# EAGLE design schemat (EAGLE 9.6.2)
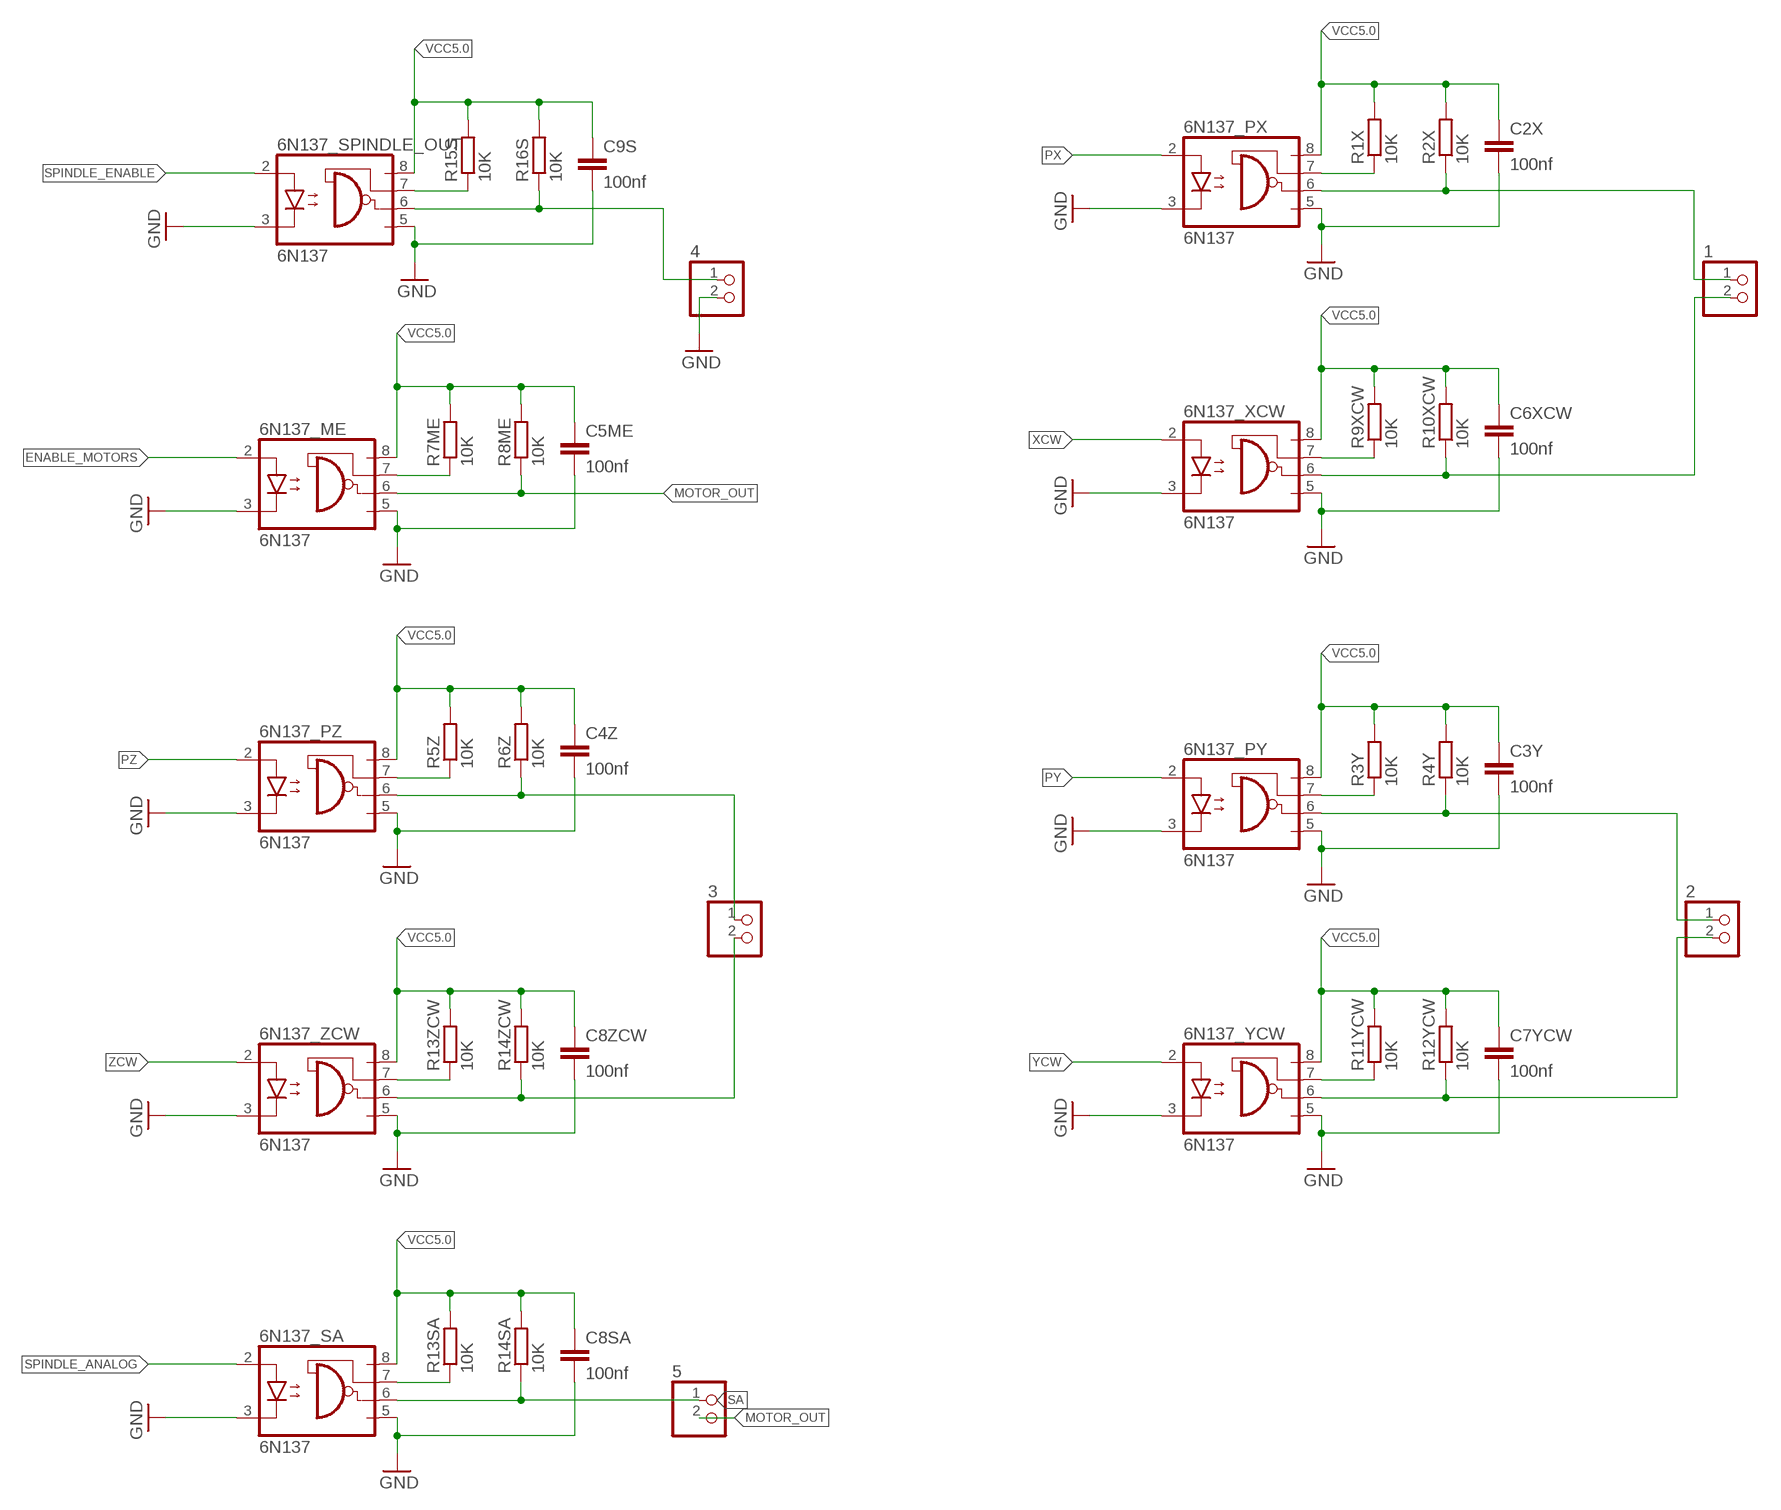
[diagram p0: schematic, sheet 1, part 1 of 2]
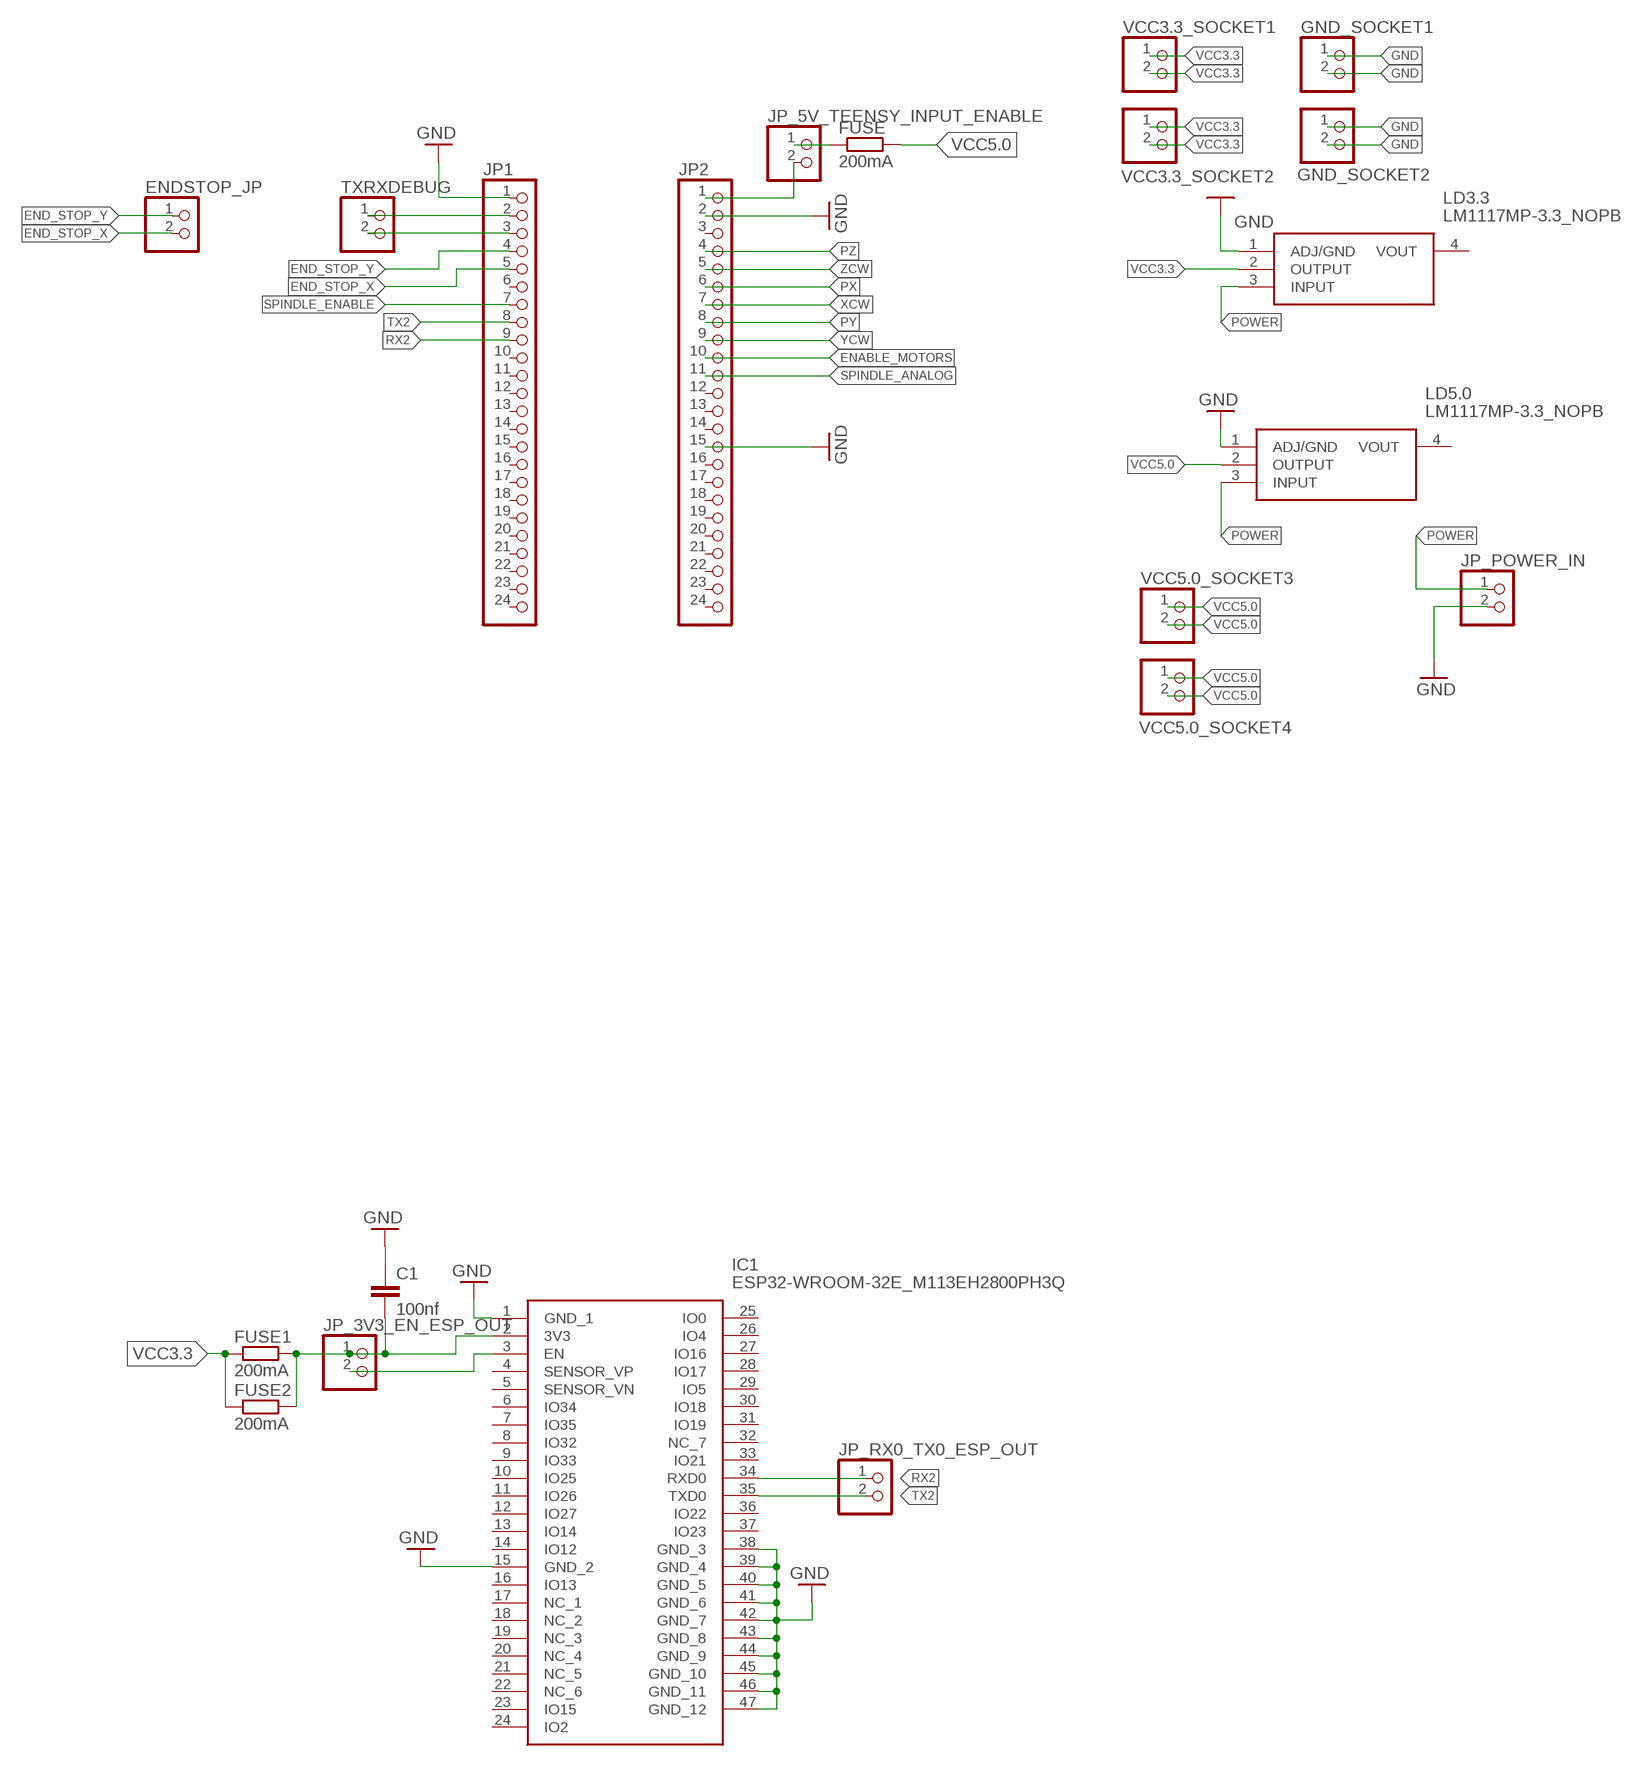
[diagram p1: schematic, sheet 1, part 2 of 2]

## Parts
1  PINHD-1X2  [1X02]
2  PINHD-1X2  [1X02]
3  PINHD-1X2  [1X02]
4  PINHD-1X2  [1X02]
5  PINHD-1X2  [1X02]
6N137_ME  6N137  [DIL08]
6N137_PX  6N137  [DIL08]
6N137_PY  6N137  [DIL08]
6N137_PZ  6N137  [DIL08]
6N137_SA  6N137  [DIL08]
6N137_SPINDLE_OUT  6N137  [DIL08]
6N137_XCW  6N137  [DIL08]
6N137_YCW  6N137  [DIL08]
6N137_ZCW  6N137  [DIL08]
C1  100nf  C-EUC0805  [C0805]
C2X  100nf  C-EUC0805  [C0805]
C3Y  100nf  C-EUC0805  [C0805]
C4Z  100nf  C-EUC0805  [C0805]
C5ME  100nf  C-EUC0805  [C0805]
C6XCW  100nf  C-EUC0805  [C0805]
C7YCW  100nf  C-EUC0805  [C0805]
C8SA  100nf  C-EUC0805  [C0805]
C8ZCW  100nf  C-EUC0805  [C0805]
C9S  100nf  C-EUC0805  [C0805]
ENDSTOP_JP  PINHD-1X2  [1X02]
FUSE  200mA  R-EU_R2512  [R2512]
FUSE1  200mA  R-EU_R2512  [R2512]
FUSE2  200mA  R-EU_R2512  [R2512]
GND_SOCKET1  PINHD-1X2  [1X02]
GND_SOCKET2  PINHD-1X2  [1X02]
IC1  ESP32-WROOM-32E_M113EH2800PH3Q  [ESP32WROOM32EM113EH2800PH3Q0]
JP1  PINHD-1X24  [1X24]
JP2  PINHD-1X24  [1X24]
JP_3V3_EN_ESP_OUT  PINHD-1X2  [1X02]
JP_5V_TEENSY_INPUT_ENABLE  PINHD-1X2  [1X02]
JP_POWER_IN  PINHD-1X2  [1X02]
JP_RX0_TX0_ESP_OUT  PINHD-1X2  [1X02]
LD3.3  LM1117MP-3.3_NOPB  [SOT230P700X180-4N]
LD5.0  LM1117MP-3.3_NOPB  [SOT230P700X180-4N]
R1X  10K  R-EU_R0805  [R0805]
R2X  10K  R-EU_R0805  [R0805]
R3Y  10K  R-EU_R0805  [R0805]
R4Y  10K  R-EU_R0805  [R0805]
R5Z  10K  R-EU_R0805  [R0805]
R6Z  10K  R-EU_R0805  [R0805]
R7ME  10K  R-EU_R0805  [R0805]
R8ME  10K  R-EU_R0805  [R0805]
R9XCW  10K  R-EU_R0805  [R0805]
R10XCW  10K  R-EU_R0805  [R0805]
R11YCW  10K  R-EU_R0805  [R0805]
R12YCW  10K  R-EU_R0805  [R0805]
R13SA  10K  R-EU_R0805  [R0805]
R13ZCW  10K  R-EU_R0805  [R0805]
R14SA  10K  R-EU_R0805  [R0805]
R14ZCW  10K  R-EU_R0805  [R0805]
R15S  10K  R-EU_R0805  [R0805]
R16S  10K  R-EU_R0805  [R0805]
TXRXDEBUG  PINHD-1X2  [1X02]
VCC3.3_SOCKET1  PINHD-1X2  [1X02]
VCC3.3_SOCKET2  PINHD-1X2  [1X02]
VCC5.0_SOCKET3  PINHD-1X2  [1X02]
VCC5.0_SOCKET4  PINHD-1X2  [1X02]

## Nets
ENABLE_MOTORS: 6N137_ME.2(A) JP2.10
END_STOP_X: ENDSTOP_JP.2 JP1.5
END_STOP_Y: ENDSTOP_JP.1 JP1.4
GND: 4.2 6N137_ME.3(C) 6N137_ME.5(GND) 6N137_PX.3(C) 6N137_PX.5(GND) 6N137_PY.3(C) 6N137_PY.5(GND) 6N137_PZ.3(C) 6N137_PZ.5(GND) 6N137_SA.3(C) 6N137_SA.5(GND) 6N137_SPINDLE_OUT.3(C) 6N137_SPINDLE_OUT.5(GND) 6N137_XCW.3(C) 6N137_XCW.5(GND) 6N137_YCW.3(C) 6N137_YCW.5(GND) 6N137_ZCW.3(C) 6N137_ZCW.5(GND) C1.1 C2X.2 C3Y.2 C4Z.2 C5ME.2 C6XCW.2 C7YCW.2 C8SA.2 C8ZCW.2 C9S.2 GND_SOCKET1.1 GND_SOCKET1.2 GND_SOCKET2.1 GND_SOCKET2.2 IC1.1(GND_1) IC1.15(GND_2) IC1.38(GND_3) IC1.39(GND_4) IC1.40(GND_5) IC1.41(GND_6) IC1.42(GND_7) IC1.43(GND_8) IC1.44(GND_9) IC1.45(GND_10) IC1.46(GND_11) IC1.47(GND_12) JP1.1 JP2.2 JP2.15 JP_POWER_IN.2 LD3.3.1(ADJ/GND) LD5.0.1(ADJ/GND)
MOTOR_OUT: 5.2 6N137_ME.6(VO) R8ME.1
N$1: JP2.1 JP_5V_TEENSY_INPUT_ENABLE.2
N$2: JP1.2 TXRXDEBUG.1
N$3: IC1.3(EN) JP_3V3_EN_ESP_OUT.2
N$4: JP1.3 TXRXDEBUG.2
N$5: 6N137_PX.7(VE) R1X.1
N$6: 6N137_PY.7(VE) R3Y.1
N$7: 6N137_PZ.7(VE) R5Z.1
N$8: 6N137_ME.7(VE) R7ME.1
N$9: 6N137_SPINDLE_OUT.7(VE) R15S.1
N$10: 6N137_XCW.7(VE) R9XCW.1
N$11: 6N137_YCW.7(VE) R11YCW.1
N$12: 6N137_ZCW.7(VE) R13ZCW.1
N$13: FUSE.1 JP_5V_TEENSY_INPUT_ENABLE.1
N$14: C1.2 FUSE1.2 FUSE2.2 IC1.2(3V3) JP_3V3_EN_ESP_OUT.1
N$15: 6N137_SA.7(VE) R13SA.1
POWER: JP_POWER_IN.1 LD3.3.3(INPUT) LD5.0.3(INPUT)
PX: 6N137_PX.2(A) JP2.6
PX_OUT: 1.1 6N137_PX.6(VO) R2X.1
PY: 6N137_PY.2(A) JP2.8
PY_OUT: 2.1 6N137_PY.6(VO) R4Y.1
PZ: 6N137_PZ.2(A) JP2.4
PZ_OUT: 3.1 6N137_PZ.6(VO) R6Z.1
RX2: IC1.34(RXD0) JP1.9 JP_RX0_TX0_ESP_OUT.1
SA: 5.1 6N137_SA.6(VO) R14SA.1
SPINDLE_ANALOG: 6N137_SA.2(A) JP2.11
SPINDLE_ENABLE: 6N137_SPINDLE_OUT.2(A) JP1.7
SPINDLE_OUT: 4.1 6N137_SPINDLE_OUT.6(VO) R16S.1
TX2: IC1.35(TXD0) JP1.8 JP_RX0_TX0_ESP_OUT.2
VCC3.3: FUSE1.1 FUSE2.1 LD3.3.2(OUTPUT) VCC3.3_SOCKET1.1 VCC3.3_SOCKET1.2 VCC3.3_SOCKET2.1 VCC3.3_SOCKET2.2
VCC5.0: 6N137_ME.8(VCC) 6N137_PX.8(VCC) 6N137_PY.8(VCC) 6N137_PZ.8(VCC) 6N137_SA.8(VCC) 6N137_SPINDLE_OUT.8(VCC) 6N137_XCW.8(VCC) 6N137_YCW.8(VCC) 6N137_ZCW.8(VCC) C2X.1 C3Y.1 C4Z.1 C5ME.1 C6XCW.1 C7YCW.1 C8SA.1 C8ZCW.1 C9S.1 FUSE.2 LD5.0.2(OUTPUT) R1X.2 R2X.2 R3Y.2 R4Y.2 R5Z.2 R6Z.2 R7ME.2 R8ME.2 R9XCW.2 R10XCW.2 R11YCW.2 R12YCW.2 R13SA.2 R13ZCW.2 R14SA.2 R14ZCW.2 R15S.2 R16S.2 VCC5.0_SOCKET3.1 VCC5.0_SOCKET3.2 VCC5.0_SOCKET4.1 VCC5.0_SOCKET4.2
XCW: 6N137_XCW.2(A) JP2.7
XCW_OUT: 1.2 6N137_XCW.6(VO) R10XCW.1
YCW: 6N137_YCW.2(A) JP2.9
YCW_OUT: 2.2 6N137_YCW.6(VO) R12YCW.1
ZCW: 6N137_ZCW.2(A) JP2.5
ZCW_OUT: 3.2 6N137_ZCW.6(VO) R14ZCW.1
Unconnected: IC1.4(SENSOR_VP) IC1.5(SENSOR_VN) IC1.6(IO34) IC1.7(IO35) IC1.8(IO32) IC1.9(IO33) IC1.10(IO25) IC1.11(IO26) IC1.12(IO27) IC1.13(IO14) IC1.14(IO12) IC1.16(IO13) IC1.17(NC_1) IC1.18(NC_2) IC1.19(NC_3) IC1.20(NC_4) IC1.21(NC_5) IC1.22(NC_6) IC1.23(IO15) IC1.24(IO2) IC1.25(IO0) IC1.26(IO4) IC1.27(IO16) IC1.28(IO17) IC1.29(IO5) IC1.30(IO18) IC1.31(IO19) IC1.32(NC_7) IC1.33(IO21) IC1.36(IO22) IC1.37(IO23) JP1.6 JP1.10 JP1.11 JP1.12 JP1.13 JP1.14 JP1.15 JP1.16 JP1.17 JP1.18 JP1.19 JP1.20 JP1.21 JP1.22 JP1.23 JP1.24 JP2.3 JP2.12 JP2.13 JP2.14 JP2.16 JP2.17 JP2.18 JP2.19 JP2.20 JP2.21 JP2.22 JP2.23 JP2.24 LD3.3.4(VOUT) LD5.0.4(VOUT)

## Library data of the parts
1-5 ENDSTOP_JP GND_SOCKET1 GND_SOCKET2 JP_3V3_EN_ESP_OUT JP_5V_TEENSY_INPUT_ENABLE JP_POWER_IN JP_RX0_TX0_ESP_OUT TXRXDEBUG VCC3.3_SOCKET1 VCC3.3_SOCKET2 VCC5.0_SOCKET3 VCC5.0_SOCKET4 = pinhead:PINHD-1X2: PIN HEADER
6N137_ME 6N137_PX 6N137_PY 6N137_PZ 6N137_SA 6N137_SPINDLE_OUT 6N137_XCW 6N137_YCW 6N137_ZCW = optocoupler:6N137: MOTOROLA OPTO COUPLER; MPN: 6N137; OC_FARNELL: 1328376; OC_NEWARK: 52M1895
C1 C2X C3Y C4Z C5ME C6XCW C7YCW C8SA C8ZCW C9S = rcl:C-EU: CAPACITOR, European symbol; SPICEPREFIX: C
FUSE FUSE1 FUSE2 R1X R2X R3Y R4Y R5Z R6Z R7ME R8ME R9XCW R10XCW R11YCW R12YCW R13SA R13ZCW R14SA R14ZCW R15S R16S = rcl:R-EU_: RESISTOR, European symbol; SPICEPREFIX: R
IC1 = SamacSys_Parts:ESP32-WROOM-32E_M113EH2800PH3Q: WiFi Modules (802.11) SMD Module ESP32-D0WD-V3, 16 MB SPI flash, PCB antenna Source: Datasheet <https://br.mouser.com/datasheet/2/891/esp32-wroom-32e_esp32-wroom-32ue_datasheet_en-1855879.pdf>; DESCRIPTION: WiFi Modules (802.11) SMD Module ESP32-D0WD-V3, 16 MB SPI flash, PCB antenna; HEIGHT: 3.35mm; MANUFACTURER_NAME: Espressif Systems; MANUFACTURER_PART_NUMBER: ESP32-WROOM-32E(M113EH2800PH3Q0); MOUSER_PART_NUMBER: 356-ESP32WRM32E128PH; MOUSER_PRICE-STOCK: https://www.mouser.co.uk/ProductDetail/Espressif-Systems/ESP32-WROOM-32EM113EH2800PH3Q0/?qs=vHuUswq2%252BsxJA4NfkQM4Lw%3D%3D
JP1 JP2 = pinhead:PINHD-1X24: PIN HEADER
LD3.3 LD5.0 = SamacSys_Parts:LM1117MP-3.3_NOPB: Space saving 800-mA low-dropout linear regulator with internal current limit Source: Datasheet <http://www.ti.com/general/docs/suppproductinfo.tsp?distId=10&gotoUrl=http://www.ti.com/lit/gpn/lm1117>; ARROW_PART_NUMBER: LM1117MP-3.3/NOPB; ARROW_PRICE-STOCK: https://www.arrow.com/en/products/lm1117mp-3.3nopb/texas-instruments; DESCRIPTION: Space saving 800-mA low-dropout linear regulator with internal current limit; HEIGHT: 1.8mm; MANUFACTURER_NAME: Texas Instruments; MANUFACTURER_PART_NUMBER: LM1117MP-3.3/NOPB; MOUSER_PART_NUMBER: 926-LM1117MP-3.3NOPB; MOUSER_PRICE-STOCK: https://www.mouser.co.uk/ProductDetail/Texas-Instruments/LM1117MP-33-NOPB/?qs=X1J7HmVL2ZFn4x9DZ4T2hA%3D%3D

## Net classes
0 VCC_POW: width 0.3 mm, drill 0.4 mm, clearance 0.3 mm

## Board
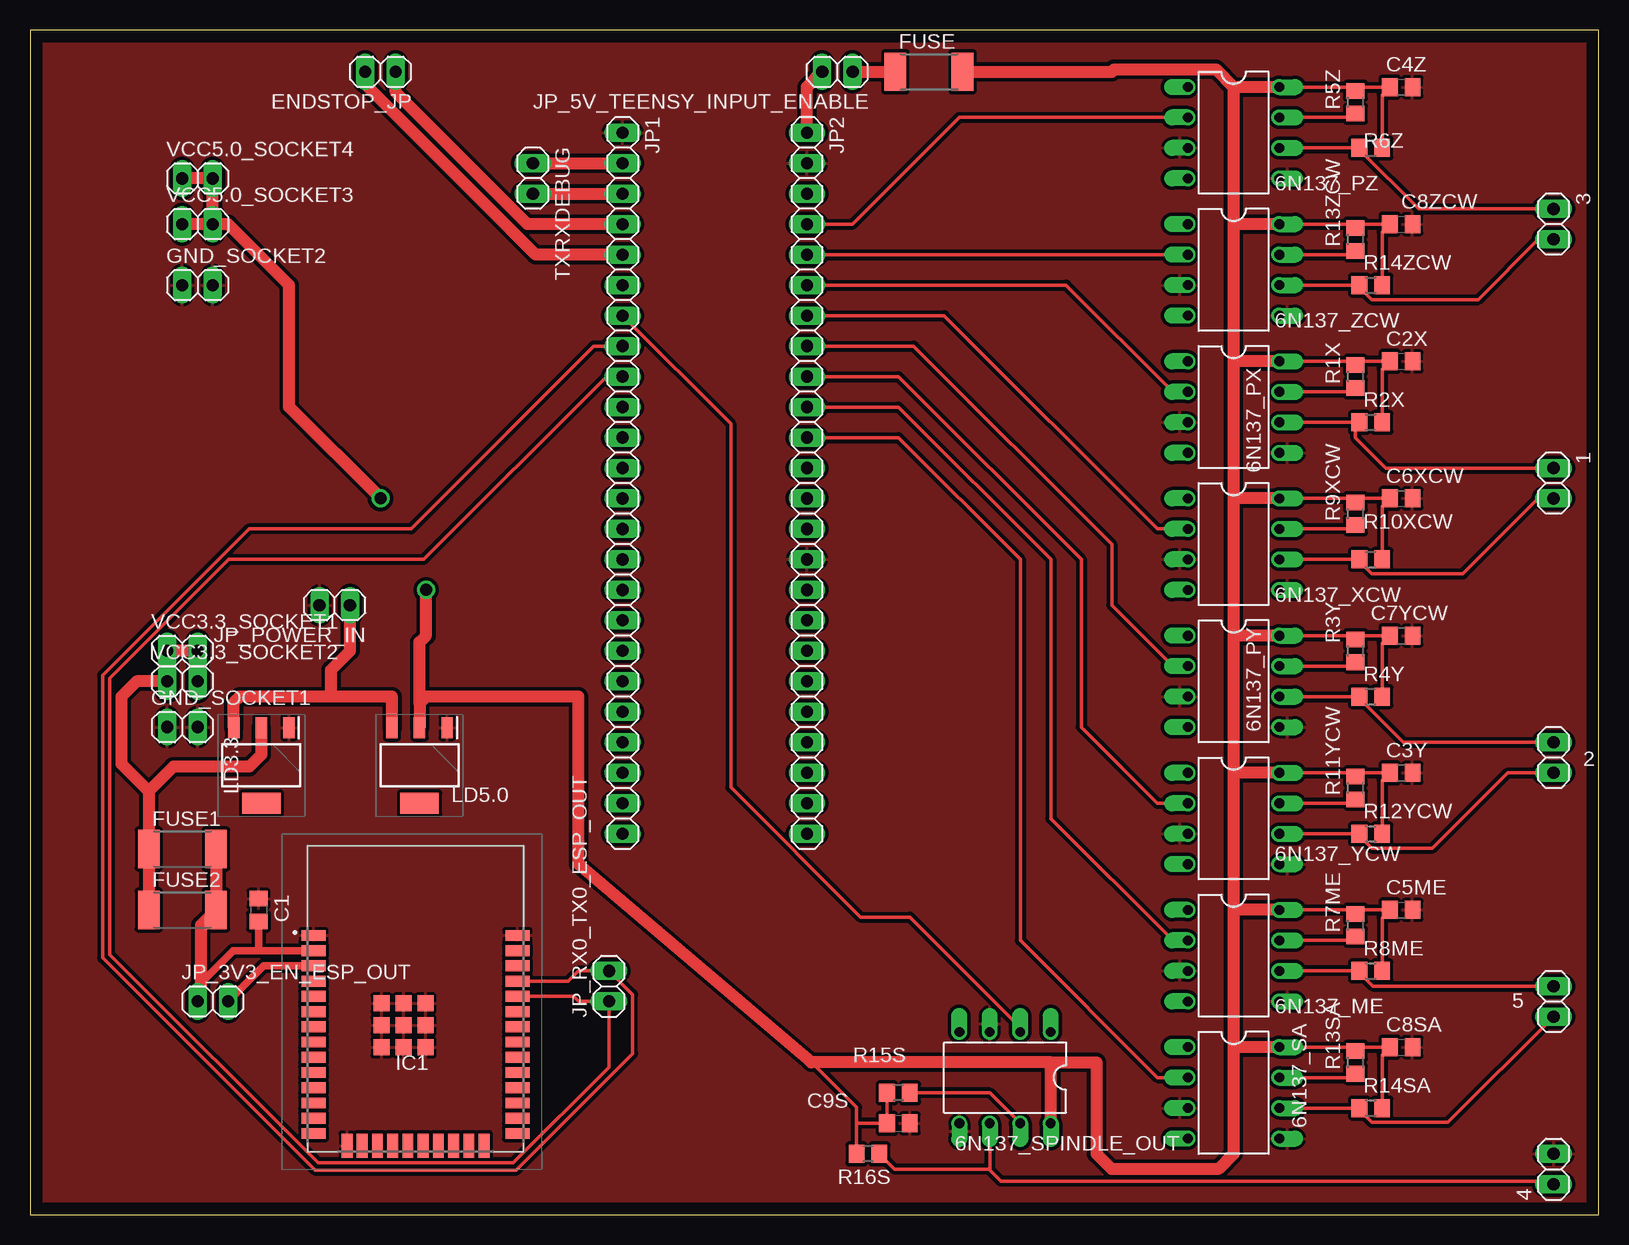
[diagram p2: board, top side]
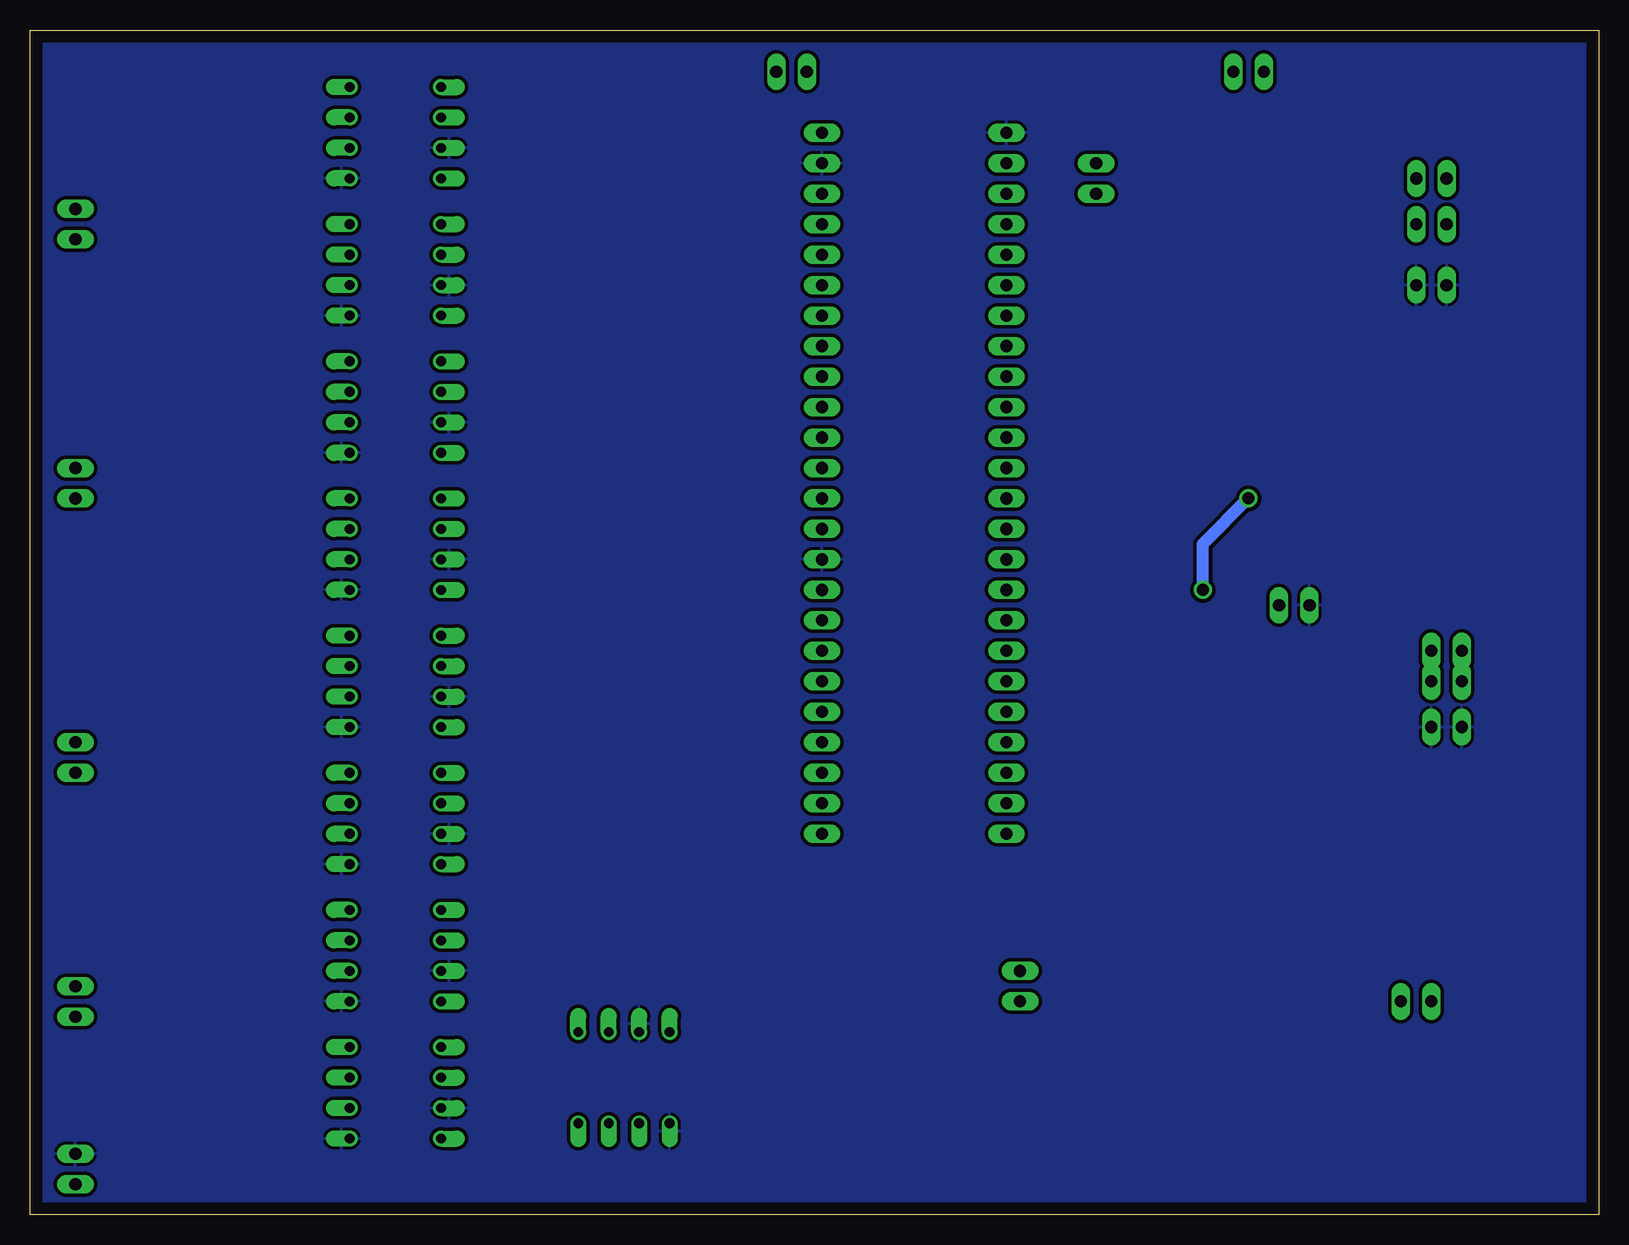
[diagram p3: board, bottom side, seen from below]

Size 130.79 x 98.73 mm. Coordinates in mm from the lower left corner, seen from the top.
Outline: 0,0 130.79,0 130.79,98.73 0,98.73 0,0
Copper layers (1*16): Top 0.035mm / dielectric 1.5mm / Bottom 0.035mm
Design rules "default": minimum track width 6mil, minimum drill 0.35mm, track to track 6mil, track to pad 6mil, pad to pad 6mil, via to via 6mil, smd to smd 6mil, copper to edge 40mil, drill to drill 6mil, minimum pad ring 10mil, minimum via ring 8mil, stop-mask expansion 4mil, vias tented up to drill 0mil, thermal gap 10mil

### Footprints (pad centres in the part's own frame; a part is rotated, then mirrored left to right if it is on the bottom)
1X02 = drill 1.016 long: 1 -1.27,0; 2 1.27,0
DIL08 = drill 0.813 offset: 1 -3.81,-3.81; 2 -1.27,-3.81; 3 1.27,-3.81; 4 3.81,-3.81; 5 3.81,3.81; 6 1.27,3.81; 7 -1.27,3.81; 8 -3.81,3.81
C0805 = smd 1.3 x 1.5: 1 -0.95,0; 2 0.95,0
R2512 = smd 1.8 x 3.2: 1 -2.8,0; 2 2.8,0
ESP32WROOM32EM113EH2800PH3Q0 = smd 2 x 0.9: 1 0.5,18.01; 2 0.5,16.74; 3 0.5,15.47; 4 0.5,14.2; 5 0.5,12.93; 6 0.5,11.66; 7 0.5,10.39; 8 0.5,9.12; 9 0.5,7.85; 10 0.5,6.58; 11 0.5,5.31; 12 0.5,4.04; 13 0.5,2.77; 14 0.5,1.5; 25 17.5,1.5; 26 17.5,2.77; 27 17.5,4.04; 28 17.5,5.31; 29 17.5,6.58; 30 17.5,7.85; 31 17.5,9.12; 32 17.5,10.39; 33 17.5,11.66; 34 17.5,12.93; 35 17.5,14.2; 36 17.5,15.47; 37 17.5,16.74; 38 17.5,18.01 | smd 0.9 x 2: 15 3.285,0.5; 16 4.555,0.5; 17 5.825,0.5; 18 7.095,0.5; 19 8.365,0.5; 20 9.635,0.5; 21 10.905,0.5; 22 12.175,0.5; 23 13.445,0.5; 24 14.715,0.5 | smd 1.33 x 1.33: 39 6.165,12.345; 40 6.165,10.51; 41 6.165,8.675; 42 8,8.675; 43 8,10.51; 44 8,12.345; 45 9.835,12.345; 46 9.835,10.51; 47 9.835,8.675
1X24 = drill 1.016 long: 1 -29.21,0; 2 -26.67,0; 3 -24.13,0; 4 -21.59,0; 5 -19.05,0; 6 -16.51,0; 7 -13.97,0; 8 -11.43,0; 9 -8.89,0; 10 -6.35,0; 11 -3.81,0; 12 -1.27,0; 13 1.27,0; 14 3.81,0; 15 6.35,0; 16 8.89,0; 17 11.43,0; 18 13.97,0; 19 16.51,0; 20 19.05,0; 21 21.59,0; 22 24.13,0; 23 26.67,0; 24 29.21,0
SOT230P700X180-4N = smd 1.75 x 0.95: 1 -3.15,2.3; 2 -3.15,0; 3 -3.15,-2.3 | smd 1.75 x 3.2: 4 3.15,0
R0805 = smd 1.3 x 1.5: 1 -0.95,0; 2 0.95,0

### Placement (x,y rotation side)
1  127,60.96 270 top
2  127,38.1 270 top
3  127,82.55 270 top
4  127,3.81 90 top
5  127,17.78 90 top
6N137_ME  100.33,21.59 270 top
6N137_PX  100.33,67.31 270 top
6N137_PY  100.33,44.45 270 top
6N137_PZ  100.33,90.17 270 top
6N137_SA  100.33,10.16 270 top
6N137_SPINDLE_OUT  81.28,11.43 180 top
6N137_XCW  100.33,55.88 270 top
6N137_YCW  100.33,33.02 270 top
6N137_ZCW  100.33,78.74 270 top
C1  19.05,25.4 270 top
C2X  114.3,71.12 0 top
C3Y  114.3,36.83 0 top
C4Z  114.3,93.98 0 top
C5ME  114.3,25.4 0 top
C6XCW  114.3,59.69 0 top
C7YCW  114.3,48.26 0 top
C8SA  114.3,13.97 0 top
C8ZCW  114.3,82.55 0 top
C9S  72.39,7.62 0 top
ENDSTOP_JP  29.21,95.25 180 top
FUSE  74.93,95.25 0 top
FUSE1  12.7,30.48 0 top
FUSE2  12.7,25.4 0 top
GND_SOCKET1  12.7,40.64 0 top
GND_SOCKET2  13.97,77.47 0 top
IC1  23.14,5.27 0 top
JP1  49.4,60.96 270 top
JP2  64.77,60.96 270 top
JP_3V3_EN_ESP_OUT  15.24,17.78 0 top
JP_5V_TEENSY_INPUT_ENABLE  67.31,95.25 180 top
JP_POWER_IN  25.4,50.8 180 top
JP_RX0_TX0_ESP_OUT  48.26,19.05 90 top
LD3.3  19.29,37.44 270 top
LD5.0  32.47,37.44 270 top
R1X  110.49,69.85 90 top
R2X  111.76,66.04 0 top
R3Y  110.49,46.99 90 top
R4Y  111.76,43.18 0 top
R5Z  110.49,92.71 90 top
R6Z  111.76,88.9 0 top
R7ME  110.49,24.13 90 top
R8ME  111.76,20.32 0 top
R9XCW  110.49,58.42 90 top
R10XCW  111.76,54.61 0 top
R11YCW  110.49,35.56 90 top
R12YCW  111.76,31.75 0 top
R13SA  110.49,12.7 90 top
R13ZCW  110.49,81.28 90 top
R14SA  111.76,8.89 0 top
R14ZCW  111.76,77.47 0 top
R15S  72.39,10.16 180 top
R16S  69.85,5.08 180 top
TXRXDEBUG  41.91,86.36 270 top
VCC3.3_SOCKET1  12.7,46.99 0 top
VCC3.3_SOCKET2  12.7,44.45 0 top
VCC5.0_SOCKET3  13.97,82.55 0 top
VCC5.0_SOCKET4  13.97,86.36 0 top

### Tracks (layer width: path | path; a pad name or v marks a point on that pad's centre or on a via)
ENABLE_MOTORS
  Top 0.3: 6N137_ME.2 95.25,22.86 85.09,33.02 85.09,54.61 72.39,67.31 JP2.10
END_STOP_X
  Top 1.016: JP1.5 42.15,80.01 27.94,94.22 ENDSTOP_JP.2
END_STOP_Y
  Top 1.016: JP1.4 41.47,82.55 30.48,93.54 ENDSTOP_JP.1
GND
  pour Top: -2.54,99.06 134.62,99.06 134.62,0 -2.54,0
  pour Bottom: -2.54,99.06 134.62,99.06 134.62,0 -2.54,0
MOTOR_OUT
  Top 0.3: 6N137_ME.6 R8ME.1 110.81,20.18 111.94,19.05 5.2
N$1
  Top 1.016: JP2.1 64.77,93.98 JP_5V_TEENSY_INPUT_ENABLE.2
N$2
  Top 1.016: TXRXDEBUG.1 JP1.2
N$3
  Top 0.61: JP_3V3_EN_ESP_OUT.2 19.47,20.74 IC1.3
N$4
  Top 1.016: TXRXDEBUG.2 JP1.3
N$5
  Top 0.3: 6N137_PX.7 110.49,68.58 R1X.1
N$6
  Top 0.3: 6N137_PY.7 110.17,45.72 R3Y.1
N$7
  Top 0.3: 6N137_PZ.7 110.49,91.44 R5Z.1
N$8
  Top 0.3: R7ME.1 110.17,22.86 6N137_ME.7
N$9
  Top 0.3: 6N137_SPINDLE_OUT.7 80.01,10.16 R15S.1
N$10
  Top 0.3: R9XCW.1 110.17,57.15 6N137_XCW.7
N$11
  Top 0.3: R11YCW.1 110.17,34.29 6N137_YCW.7
N$12
  Top 0.3: 6N137_ZCW.7 110.49,80.01 R13ZCW.1
N$13
  Top 1.016: JP_5V_TEENSY_INPUT_ENABLE.1 FUSE.1
N$14
  Top 0.61: JP_3V3_EN_ESP_OUT.1 13.97,19.05 16.93,22.01 19.05,22.01 | 19.05,22.01 IC1.2 | C1.2 19.05,22.01
  Top 1.016: FUSE1.2 FUSE2.2 14.23,24.13 14.23,18.04 JP_3V3_EN_ESP_OUT.1
N$15
  Top 0.3: 6N137_SA.7 110.17,11.43 R13SA.1
POWER
  Top 1.016: LD3.3.3 16.99,42.7 17.47,43.18 25.09,43.18 | LD5.0.3 30.17,43.18 25.09,43.18 | 25.09,43.18 25.09,45.41 26.67,46.99 JP_POWER_IN.1
PX
  Top 0.3: JP2.6 86.36,77.47 95.25,68.58 6N137_PX.2
PX_OUT
  Top 0.3: 6N137_PX.6 R2X.1 110.49,65.72 110.49,64.77 113.03,62.23 1.1
PY
  Top 0.3: JP2.8 73.66,72.39 90.17,55.88 90.17,50.8 95.25,45.72 6N137_PY.2
PY_OUT
  Top 0.3: 6N137_PY.6 R4Y.1 110.81,43.04 114.48,39.37 2.1
PZ
  Top 0.3: JP2.4 68.58,82.55 77.47,91.44 6N137_PZ.2
PZ_OUT
  Top 0.3: 6N137_PZ.6 R6Z.1 110.81,88.76 115.75,83.82 3.1
RX2
  Top 0.3: IC1.34 45.3,18.2 45.72,17.78 JP_RX0_TX0_ESP_OUT.1 48.26,12.3 40.28,4.32 24,4.32 6.66,21.66 6.66,44.7 16.57,54.61 32.8,54.61 48.04,69.85 JP1.9
SA
  Top 0.3: 6N137_SA.6 R14SA.1 110.81,8.75 111.87,7.69 118.18,7.69 5.1
SPINDLE_ANALOG
  Top 0.3: JP2.11 72.39,64.77 82.55,54.61 82.55,22.86 93.98,11.43 6N137_SA.2
SPINDLE_ENABLE
  Top 0.3: JP1.7 58.42,65.91 58.42,35.62 69.25,24.8 73.34,24.8 82.55,15.59 6N137_SPINDLE_OUT.2
SPINDLE_OUT
  Top 0.3: 80.01,3.81 80.01,3.71 80.93,2.79 126.75,2.79 4.1 | 80.01,3.81 6N137_SPINDLE_OUT.6 | 80.01,3.81 72.07,3.81 R16S.1
TX2
  Top 0.3: IC1.35 44.87,19.47 45.72,20.32 JP_RX0_TX0_ESP_OUT.2 50.23,18.35 50.23,13.43 40.53,3.72 23.75,3.72 6.06,21.41 6.06,44.95 18.27,57.15 31.75,57.15 46.99,72.39 JP1.8
VCC3.3
  Top 1.016: LD3.3.2 19.29,38.34 18.29,37.34 11.94,37.34 9.9,35.3 | 9.9,35.3 FUSE1.1 FUSE2.1 | VCC3.3_SOCKET2.2 VCC3.3_SOCKET1.2 VCC3.3_SOCKET1.1 VCC3.3_SOCKET2.1 8.89,44.45 7.62,43.18 7.62,37.58 9.9,35.3
VCC5.0  (via drill 1)
  Top 0.3: 6N137_ME.8 110.17,25.4 R7ME.2 110.81,25.4 C5ME.1 112.71,24.76 R8ME.2 | 6N137_SA.8 110.17,13.97 R13SA.2 110.81,13.97 C8SA.1 112.71,13.33 R14SA.2 | R15S.2 C9S.1 68.9,7.62 | 6N137_YCW.8 110.17,36.83 R11YCW.2 110.81,36.83 C3Y.1 112.71,36.19 R12YCW.2 | 6N137_PY.8 110.17,48.26 | 110.17,48.26 R3Y.2 | 110.17,48.26 C7YCW.1 112.71,47.62 R4Y.2 | 6N137_XCW.8 110.17,59.69 | 110.17,59.69 R9XCW.2 | 110.17,59.69 C6XCW.1 112.71,59.05 R10XCW.2 | 6N137_PX.8 110.17,71.12 | 110.17,71.12 R1X.2 | 110.17,71.12 C2X.1 112.71,70.48 R2X.2 | 6N137_ZCW.8 110.17,82.55 R13ZCW.2 110.81,82.55 C8ZCW.1 112.71,81.91 R14ZCW.2 | R6Z.2 112.71,93.34 C4Z.1 110.81,93.98 R5Z.2 110.17,93.98 6N137_PZ.8 | R16S.2 68.9,7.62 | 68.9,7.62 68.9,8.94 65.14,12.7
  Top 1.016: 100.33,93.98 100.33,82.55 | 100.33,82.55 100.33,71.12 | 100.33,71.12 100.33,59.69 | 100.33,59.69 100.33,48.26 | 100.33,48.26 100.33,36.83 | 100.33,36.83 100.33,25.4 | 100.33,25.4 100.33,13.97 | 100.33,13.97 100.33,5.08 99.06,3.81 90.17,3.81 88.9,5.08 88.9,12.7 85.09,12.7 | 6N137_SA.8 100.33,13.97 | 6N137_ME.8 100.33,25.4 | 6N137_YCW.8 100.33,36.83 | 6N137_PY.8 100.33,48.26 | 6N137_XCW.8 100.33,59.69 | 6N137_PX.8 100.33,71.12 | 6N137_ZCW.8 100.33,82.55 | 6N137_SPINDLE_OUT.8 85.09,12.7 | 85.09,12.7 65.14,12.7 45.72,29.21 45.72,43.18 33.02,43.18 32.47,42.63 | 32.47,42.63 LD5.0.2 | FUSE.2 90.17,95.25 90.37,95.45 98.86,95.45 100.33,93.98 | 6N137_PZ.8 100.33,93.98 | 32.47,42.63 32.47,47.71 33.02,48.26 v33.02,52.07 | v29.21,59.69 21.59,67.31 21.59,77.47 16.51,82.55 VCC5.0_SOCKET3.2 | VCC5.0_SOCKET3.2 VCC5.0_SOCKET3.1 | VCC5.0_SOCKET3.2 VCC5.0_SOCKET4.2 VCC5.0_SOCKET4.1
  Bottom 1.016: v33.02,52.07 33.02,55.88 v29.21,59.69
XCW
  Top 0.3: JP2.7 76.2,74.93 93.98,57.15 6N137_XCW.2
XCW_OUT
  Top 0.3: 6N137_XCW.6 R10XCW.1 110.81,54.47 111.87,53.41 119.45,53.41 125.73,59.69 1.2
YCW
  Top 0.3: JP2.9 72.39,69.85 87.63,54.61 87.63,40.64 93.98,34.29 6N137_YCW.2
YCW_OUT
  Top 0.3: 6N137_YCW.6 R12YCW.1 110.81,31.61 111.87,30.55 116.91,30.55 123.19,36.83 2.2
ZCW
  Top 0.3: JP2.5 6N137_ZCW.2
ZCW_OUT
  Top 0.3: 6N137_ZCW.6 R14ZCW.1 110.81,77.33 111.87,76.27 120.72,76.27 125.73,81.28 3.2